# EAGLE design EEZ DIB AUX PS r2B1 (EAGLE 7.2.0)
Assembly variants: Farnell, TME

## Sheet 1 of 2: Power board tester
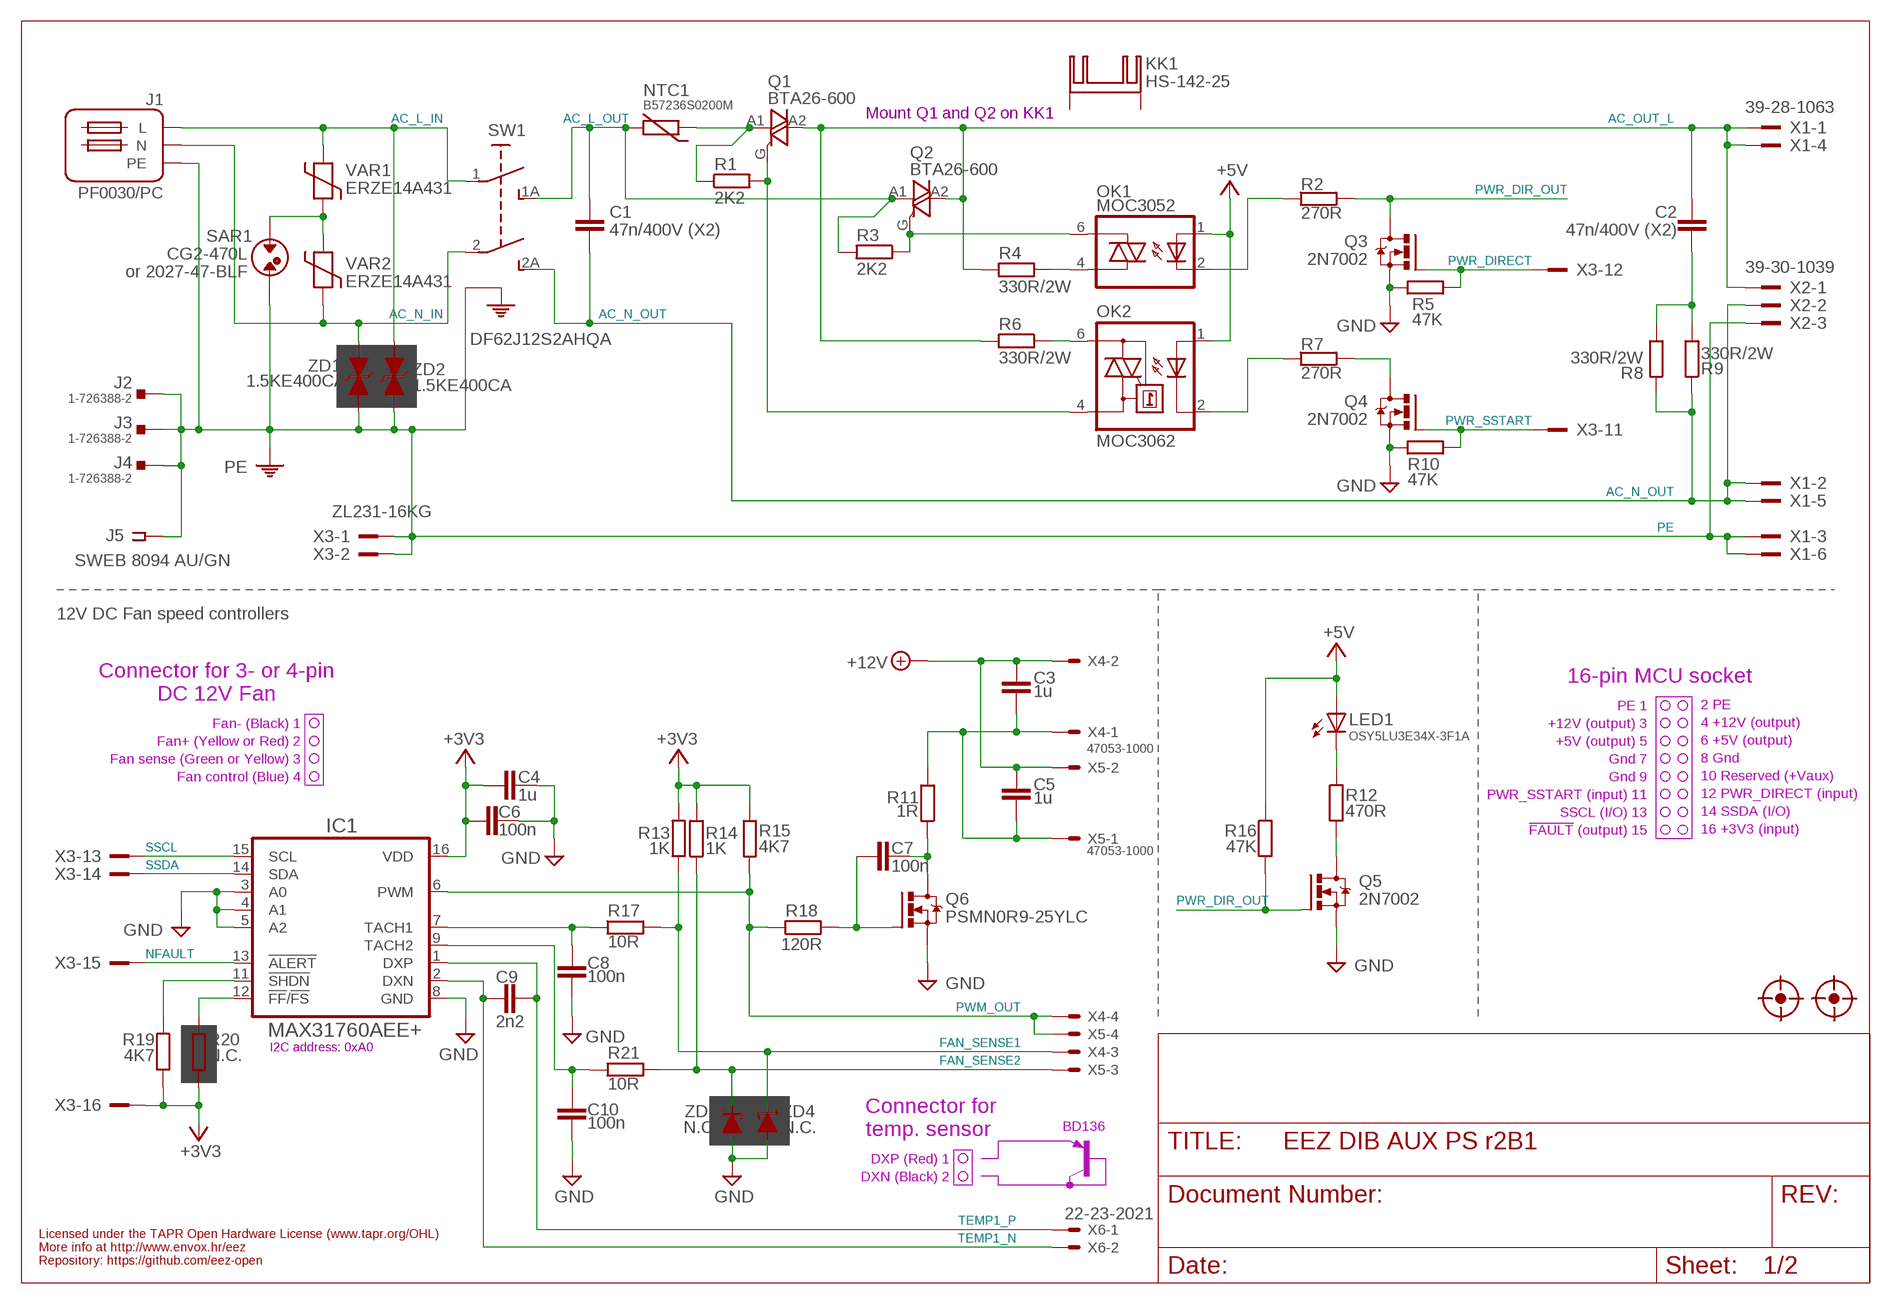
[diagram p0: schematic, sheet 1]

### Parts
C1  47n/400V (X2)  C-EU102-054X133  [C102-054X133]
C2  47n/400V (X2)  C-EU102-054X133  [C102-054X133]
C3  1u  C-EUC0805  [C0805]
C4  1u  C-EUC0805  [C0805]
C5  1u  C-EUC0805  [C0805]
C6  100n  C-EUC0603  [C0603]
C7  100n  C-EUC0805  [C0805]
C8  100n  C-EUC0603  [C0603]
C9  2n2  C-EUC0805  [C0805]
C10  100n  C-EUC0603  [C0603]
FM1  FIDUCIAL  [FIDUCIAL]
FM2  FIDUCIAL  [FIDUCIAL]
IC1  MAX31760AEE+  [DBQ16]
J1  PF0030/PC  [PF0030/PC]
J2  1-726388-2  PCB_TAB4.8MM  [PCB_TAB-4.8MM]
J3  1-726388-2  PCB_TAB4.8MM  [PCB_TAB-4.8MM]
J4  1-726388-2  PCB_TAB4.8MM  [PCB_TAB-4.8MM]
J5  SWEB 8094 AU/GN  BINDING_POSTCLIFF  [S16N-PC]
KK1  HS-142-25  SK129-PAD  [SK129]
LED1  OSY5LU3E34X-3F1A  LEDOSG8  [OSG8]
NTC1  B57236S0200M  NTC11.5X6  [NTC_11.5X6_RM5]
OK1  MOC3052  MOC305X  [DIL6-SMD]
OK2  MOC3062  MOC3033S  [DIL6-SMD]
Q1  BTA26-600  BTA26-V  [TOP3S-1]
Q2  BTA26-600  BTA26-V  [TOP3S-1]
Q3  2N7002  [SOT103P240X110-3N]
Q4  2N7002  [SOT103P240X110-3N]
Q5  2N7002  [SOT103P240X110-3N]
Q6  PSMN0R9-25YLC  N-MOSFETLFPAK  [SOT669]
R1  2K2  R-EU_R0805  [R0805]
R2  270R  R-EU_R0805  [R0805]
R3  2K2  R-EU_R0805  [R0805]
R4  330R/2W  R-EU_R2512  [R2512]
R5  47K  R-EU_R0805  [R0805]
R6  330R/2W  R-EU_R2512  [R2512]
R7  270R  R-EU_R0805  [R0805]
R8  330R/2W  R-EU_R2512  [R2512]
R9  330R/2W  R-EU_R2512  [R2512]
R10  47K  R-EU_R0805  [R0805]
R11  1R  R-EU_R0805  [R0805]
R12  470R  R-EU_R0805  [R0805]
R13  1K  R-EU_R0805  [R0805]
R14  1K  R-EU_R0805  [R0805]
R15  4K7  R-EU_R0805  [R0805]
R16  47K  R-EU_R0805  [R0805]
R17  10R  R-EU_R0805  [R0805]
R18  120R  R-EU_R0805  [R0805]
R19  4K7  R-EU_R0805  [R0805]
R20  N.C.  R-EU_R0805  [R0805]
R21  10R  R-EU_R0805  [R0805]
SAR1  CG2-470L  SAR  [SAR]
SW1  DF62J12S2AHQA  [DF62J12S2]
VAR1  ERZE14A431  VARISTOR-13  [VARISTOR_13MM]
VAR2  ERZE14A431  VARISTOR-13  [VARISTOR_13MM]
X1  39-28-1063  MINIFIT_5566-06A-CRE  [MINIFIT_5566-06A_CRE]
X2  39-30-1039  MINIFIT_39301039-CREEPAGE  [MINIFIT_39301039_CRE]
X3  ZL231-16KG  IDC-16PIN-ANGLED  [ML16L]
X4  47053-1000  [47053-1000]
X5  47053-1000  [47053-1000]
X6  22-23-2021  [22-23-2021]
ZD1  1.5KE400CA  1.5KE-BIDIR  [DO201-BIDIR]
ZD2  1.5KE400CA  1.5KE-BIDIR  [DO201-BIDIR]
ZD3  N.C.  ZENER-DIODESOD123  [SOD123]
ZD4  N.C.  ZENER-DIODESOD123  [SOD123]

### Nets
+3V3: C4.2 C6.2 IC1.16(VDD) R13.2 R14.2 R15.1 R19.2 R20.2 X3.16
+5V: LED1.A OK1.1(A) OK2.1(A) R16.1 ; also sheet 2
+12V: C3.1 C5.1 X4.2 X5.2 ; also sheet 2
AC_L_IN: J1.L SW1.1(P) VAR1.2 ZD2.A
AC_L_OUT: C1.1 NTC1.1 Q2.A1 R3.2 SW1.1A(S) ; also sheet 2
AC_N_IN: J1.N SW1.2(P1) VAR2.1 ZD1.A
AC_N_OUT: C1.2 R8.1 R9.1 SW1.2A(S1) X1.2 X1.5 X2.2 ; also sheet 2
AC_OUT_L: C2.1 Q1.A2 Q2.A2 R4.2 R6.2 X1.1 X1.4 X2.1
DRAIN: C7.1 Q6.MB(D) R11.1
FAN_OUT: C3.2 C5.2 R11.2 X4.1 X5.1
FAN_SENSE1: R13.1 R17.2 X4.3 ZD4.C
FAN_SENSE2: R14.1 R21.2 X5.3 ZD3.C
GND [gnd]: C4.1 C6.1 C8.2 C10.2 IC1.3(A0) IC1.4(A1) IC1.5(A2) IC1.8(GND) Q3.2(S) Q4.2(S) Q5.2(S) Q6.1(S) Q6.2(S) Q6.3(S) R5.1 R10.1 ZD3.A ZD4.A ; also sheet 2
N$1: NTC1.2 Q1.A1 R1.1
N$2: C8.1 IC1.7(TACH1) R17.1
N$3: IC1.12(!FF!/!FS!) R20.1
N$6: SAR1.P$1 VAR1.1 VAR2.2
N$7: OK2.2(C) R7.1
N$10: OK1.2(C) R2.1
N$13: Q5.3(D) R12.2
N$14: LED1.C R12.1
N$15: C7.2 Q6.4(G) R18.2
N$16: Q4.3(D) R7.2
N$18: IC1.11(!SHDN) R19.1
N$21: C10.1 IC1.9(TACH2) R21.1
N$71: OK1.6(A2) Q2.G R3.1
N$72: OK2.4(A1) Q1.G R1.2
N$73: OK2.6(A2) R6.1
N$76: OK1.4(A1) R4.1
N$83: C2.2 R8.2 R9.2
NFAULT: IC1.13(!ALERT) X3.15
PE: J1.PE J2.P$1 J2.P$2 J3.P$1 J3.P$2 J4.P$1 J4.P$2 J5.1 J5.NC1 J5.NC2 J5.NC3 J5.NC4 SAR1.P$2 SW1.PE1(PE) SW1.PE2(PE) X1.3 X1.6 X2.3 X3.1 X3.2 ZD1.C ZD2.C ; also sheet 2
PWM_OUT: IC1.6(PWM) R15.2 R18.1 X4.4 X5.4
PWR_DIR_OUT: Q3.3(D) Q5.1(G) R2.2 R16.2
PWR_DIRECT: Q3.1(G) R5.2 X3.12
PWR_SSTART: Q4.1(G) R10.2 X3.11
SSCL: IC1.15(SCL) X3.13
SSDA: IC1.14(SDA) X3.14
TEMP1_N [diff]: C9.2 IC1.2(DXN) X6.2
TEMP1_P [diff]: C9.1 IC1.1(DXP) X6.1
Unconnected: KK1.A2,5(K) KK1.B2,5(K) X3.10

### Notes on the sheet
- Mount Q1 and Q2 on KK1
- or 2027-47-BLF
- 12V DC Fan speed controllers
- 16-pin MCU socket
- Connector for 3- or 4-pin
  DC 12V Fan
- PE 1
- 2 PE
- Fan- (Black) 1 | +12V (output) 3
- 4 +12V (output)
- Fan+ (Yellow or Red) 2 | +5V (output) 5
- 6 +5V (output)
- Fan sense (Green or Yellow) 3 | Gnd 7
- 8 Gnd
- Fan control (Blue) 4 | Gnd 9
- 10 Reserved (+Vaux)
- PWR_SSTART (input) 11
- 12 PWR_DIRECT (input)
- SSCL (I/O) 13
- 14 SSDA (I/O)
- !FAULT! (output) 15
- 16 +3V3 (input)
- I2C address: 0xA0
- BD136
- Connector for
  temp. sensor
- DXP (Red) 1
- DXN (Black) 2
- Licensed under the TAPR Open Hardware License (www.tapr.org/OHL)
- More info at http://www.envox.hr/eez
- Repository: https://github.com/eez-open

## Sheet 2 of 2
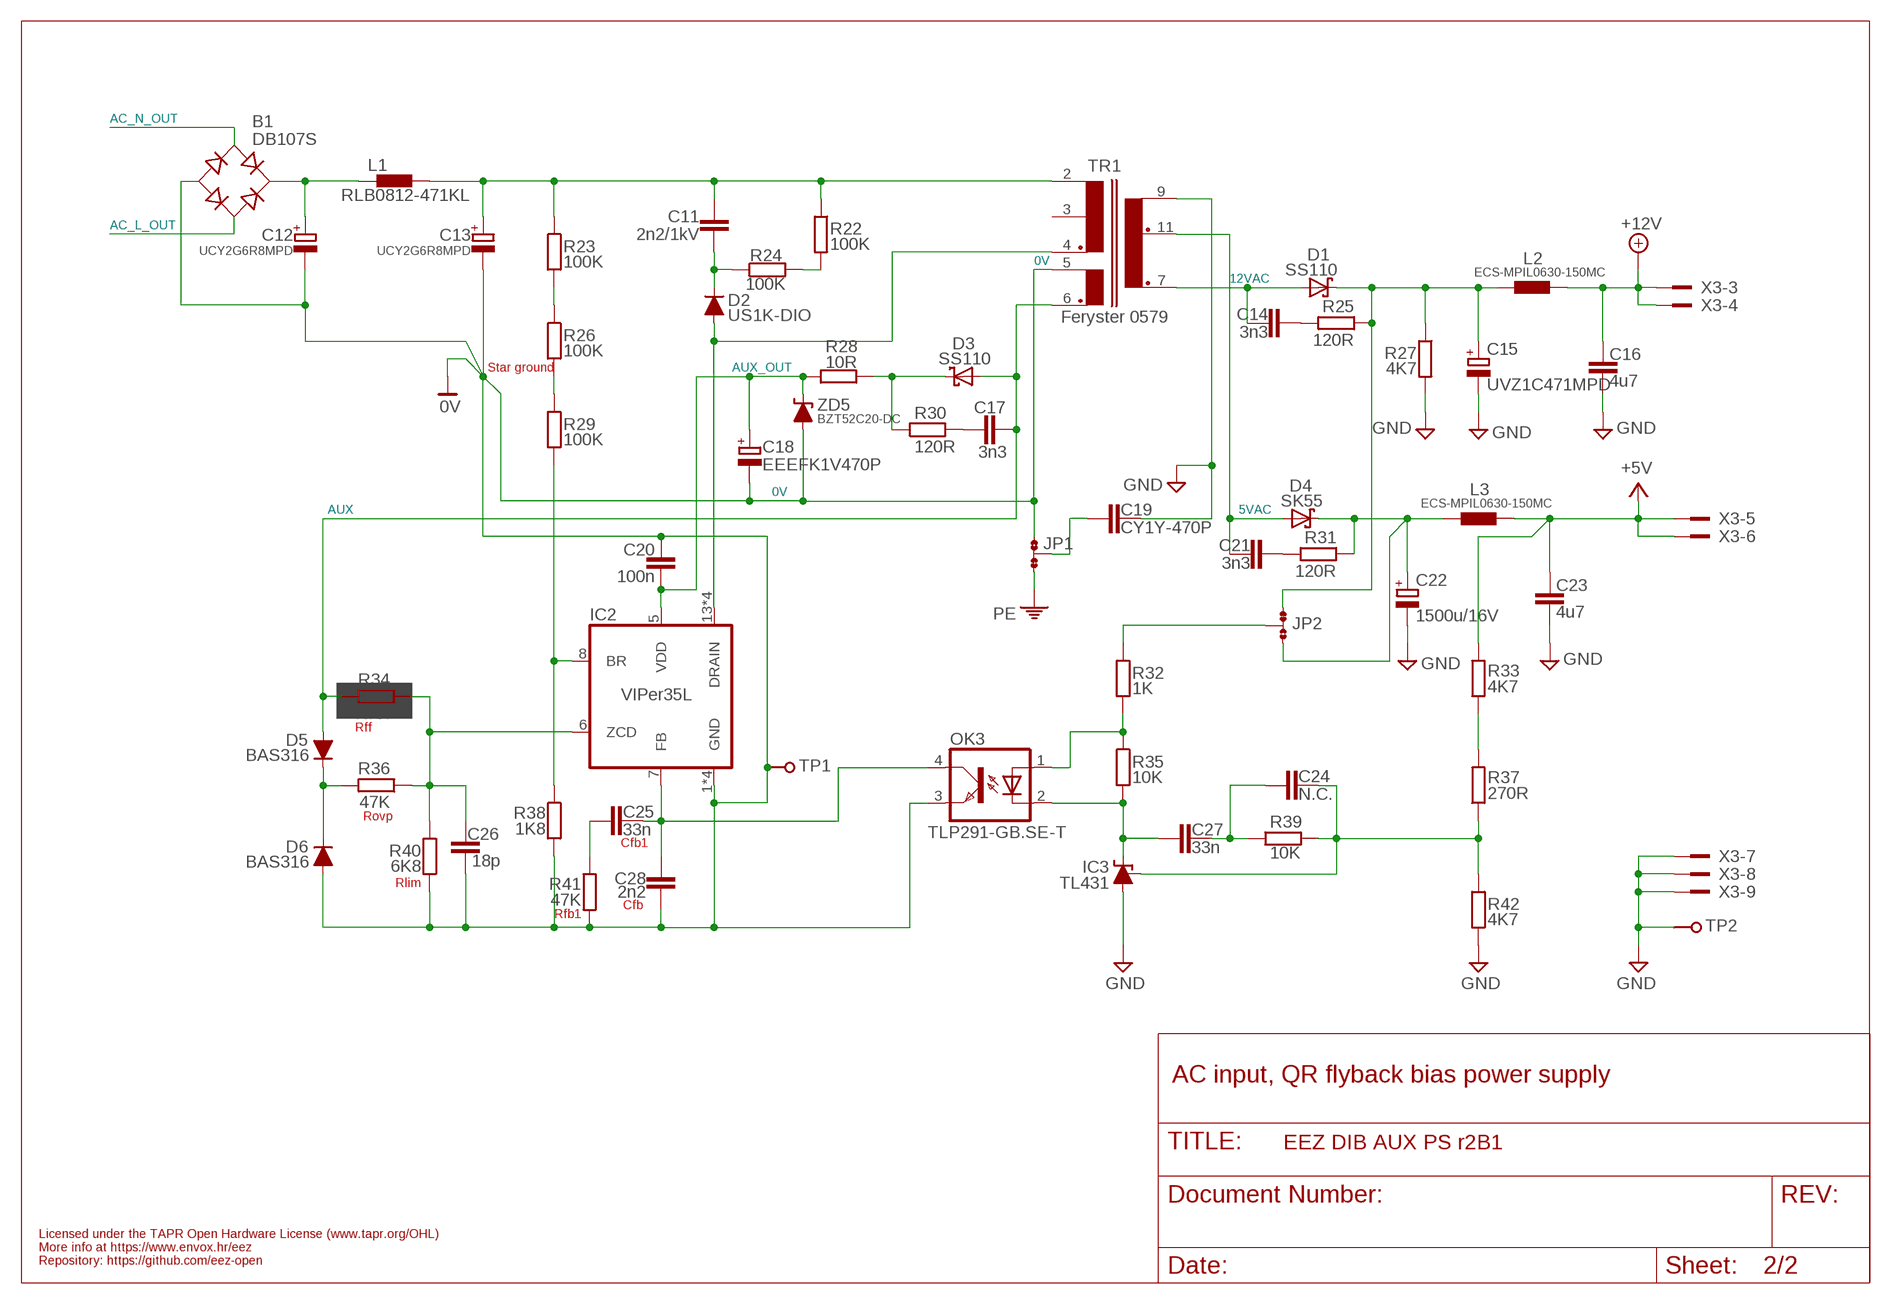
[diagram p1: schematic, sheet 2]

### Parts
B1  DB107S  DBS107G  [DBS]
C11  2n2/1kV  C-EUC1210  [C1210]
C12  UCY2G6R8MPD  ECAP5G_10.5MM  [ECAP5/10.5]
C13  UCY2G6R8MPD  ECAP5G_10.5MM  [ECAP5/10.5]
C14  3n3  C-EUC0805  [C0805]
C15  UVZ1C471MPD  ECAP3.5G_8MM  [ECAP3.5/8]
C16  4u7  C-EUC1210  [C1210]
C17  3n3  C-EUC0805  [C0805]
C18  EEEFK1V470P  ECAPPANASONIC_H  [CAPAE660X610N]
C19  CY1Y-470P  C-EUCY  [CY075-032X103]
C20  100n  C-EUC0603  [C0603]
C21  3n3  C-EUC0805  [C0805]
C22  1500u/16V  ECAP5G_13MM  [ECAP5/13]
C23  4u7  C-EUC1210  [C1210]
C24  N.C.  C-EUC0805  [C0805]
C25  33n  C-EUC0805  [C0805]
C26  18p  C-EUC0603  [C0603]
C27  33n  C-EUC0805  [C0805]
C28  2n2  C-EUC0805  [C0805]
D1  SS110  SCHOTTKYSMB  [SMB]
D2  US1K-DIO  DIODEDO214AA  [DO214AA]
D3  SS110  SCHOTTKYSMB  [SMB]
D4  SK55  SCHOTTKYSMB  [SMB]
D5  BAS316  DIODESOD323R  [SOD323-R]
D6  BAS316  DIODESOD323R  [SOD323-R]
IC2  VIPer35L  VIPER35  [SOIC-16]
IC3  TL431  [SOT103P240X110-3N]
JP1  JP3-CUT  [JP3-CUT]
JP2  JP3-CUT  [JP3-CUT]
L1  RLB0812-471KL  FERYSTER_DSZ6  [FERSYTER_DSZ6]
L2  ECS-MPIL0630-150MC  DE0704  [DE0704]
L3  ECS-MPIL0630-150MC  DE0704  [DE0704]
OK3  TLP291-GB.SE-T  TLP291  [SO4]
R22  100K  R-EU_R1206  [R1206]
R23  100K  R-EU_R1206  [R1206]
R24  100K  R-EU_R1206  [R1206]
R25  120R  R-EU_R0805  [R0805]
R26  100K  R-EU_R1206  [R1206]
R27  4K7  R-EU_R0805  [R0805]
R28  10R  R-EU_R0805  [R0805]
R29  100K  R-EU_R1206  [R1206]
R30  120R  R-EU_R0805  [R0805]
R31  120R  R-EU_R0805  [R0805]
R32  1K  R-EU_R0805  [R0805]
R33  4K7  R-EU_R0805  [R0805]
R34  N.C.  R-EU_R0805  [R0805]
R35  10K  R-EU_R0805  [R0805]
R36  47K  R-EU_R0805  [R0805]
R37  270R  R-EU_R0805  [R0805]
R38  1K8  R-EU_R0805  [R0805]
R39  10K  R-EU_R0805  [R0805]
R40  6K8  R-EU_R0805  [R0805]
R41  47K  R-EU_R0805  [R0805]
R42  4K7  R-EU_R0805  [R0805]
TP1  PCB_TEST_TABSHIELD  [PCB_SHIELD_TAB]
TP2  PCB_TEST_TABSHIELD  [PCB_SHIELD_TAB]
TR1  Feryster 0579  FERYSTER_0579  [FERYSTER_0579]
ZD5  BZT52C20-DC  ZENER-DIODESOD123  [SOD123]

### Nets
0V: B1.- C12.- C13.- C18.2(-) C20.1 C26.2 C28.2 D6.A IC2.1(GND) IC2.2(GND) IC2.3(GND) IC2.4(GND) JP1.NO OK3.3(EMIT) R38.2 R40.1 R41.2 TP1.1 TR1.5(AUX) ZD5.A
5VAC: C21.2 D4.A TR1.11(S1_DOT)
12VAC: C14.2 D1.A TR1.7(S2_DOT)
+5V: C23.1 L3.2 R33.2 X3.5 X3.6 ; also sheet 1
+5V_REC: C22.+ D4.C JP2.NO L3.1 R31.1
+12V: C16.1 L2.2 X3.3 X3.4 ; also sheet 1
+12V_REC: C15.+ D1.C JP2.NC L2.1 R25.1 R27.1
AC_L_OUT: B1.AC2 ; also sheet 1
AC_N_OUT: B1.AC1 ; also sheet 1
AUX: C17.2 D3.A D5.A R34.2 TR1.6(AUX_DOT)
AUX_OUT: C18.1(+) C20.2 IC2.5(VDD) R28.2 ZD5.C
AUX_REC: D3.C R28.1 R30.1
DC_BUS: C11.1 C13.+ L1.P$2 R22.1 R23.1 TR1.2(P1)
FB1: C27.1 IC3.1(C) OK3.2(C) R35.2
GND [gnd]: C15.- C16.2 C19.2 C22.- C23.2 IC3.3(A) R27.2 R42.1 TP2.1 TR1.9(S_COMM) X3.7 X3.8 X3.9 ; also sheet 1
N$4: C19.1 JP1.COM
N$5: OK3.1(A) R32.2 R35.1
N$8: C14.1 R25.2
N$9: B1.+ C12.+ L1.P$1
N$11: R26.2 R29.1
N$12: JP2.COM R32.1
N$17: R22.2 R24.2
N$20: IC2.8(BR) R29.2 R38.1
N$22: R33.1 R37.2
N$49: R23.2 R26.1
N$137: C11.2 D2.C R24.1
N$138: C25.2 C28.1 IC2.7(FB) OK3.4(COL)
N$140: C17.1 R30.2
N$141: C26.1 IC2.6(ZCD) R34.1 R36.1 R40.2
N$146: C21.1 R31.2
N$148: C24.2 IC3.2(REF) R37.1 R39.2 R42.2
N$149: C24.1 C27.2 R39.1
N$152: C25.1 R41.1
N$155: D5.C D6.C R36.2
PE: JP1.NC ; also sheet 1
VIPER_D: D2.A IC2.13(DRAIN) IC2.14(DRAIN) IC2.15(DRAIN) IC2.16(DRAIN) TR1.4(P1_DOT)
Unconnected: TR1.3(P1_MIDDLE)

### Notes on the sheet
- Star ground
- Rff
- Rovp
- Cfb1
- Rlim
- Cfb
- Rfb1
- AC input, QR flyback bias power supply
- Licensed under the TAPR Open Hardware License (www.tapr.org/OHL)
- More info at https://www.envox.hr/eez
- Repository: https://github.com/eez-open

## Library data of the parts
B1 = rectifier:DB?*G: Single Phase 1.0 AMP Glass Passivated Bridge Rectifier Taiwan Semiconductor Co.,Ltd. - TSC Source: http://www.taiwansemi.com/TSCbig5/ezcatfiles/cust/img/img/db101g.pdf http://www.ts.com.tw/db/pictures/modules/PDT/PDT060207001/DBLS201G.pdf
C1-C11 C14 C16 C17 C20 C21 C23-C28 = rcl:C-EU: CAPACITOR, European symbol
C12 C13 C15 C18 C22 = EEZ_Lib1:ECAP
C19 = EEZ_Lib1:C-EU
D1 D3 D4 = EEZ_Lib1:SCHOTTKY
D2 D5 D6 = EEZ_Lib1:DIODE
FM1 FM2 = EEZ_Lib1:FIDUCIAL: Fiducial mark for pick and place automation
IC1 = EEZ_DIB:MAX31760AEE+: Precision Fan-Speed Controller with Nonvolatile Lookup Table
IC2 = EEZ_Lib1:VIPER35: Quasi-resonant high performance off line high voltage converter, 800 V
IC3 = EEZ_Lib1:TL431: Precision programmable reference
J1 = EEZ_connectors:PF0030/PC: PC Flanged Mount Fused Inlet, twin fused 5 x 20 mm, 250 Vac, 10 A, PC spills
J2-J4 = EEZ_connectors:PCB_TAB
J5 = EEZ_Lib1:BINDING_POST: Various 4 mm binding posts
JP1 JP2 = EEZ_Lib1:JP3-CUT
KK1 = EEZ_DIB:SK129-PAD: Extruded heatsink; SOT32,TO220,TO3P; L:25.4mm; 7.8K/W Compatible model: Stonecold HS-142-25
L1 = EEZ_Lib1:FERYSTER_DSZ6: Feryster DSZ type choke on RSZ ferrite core
L2 L3 = EEZ_inductors_and_transformers:DE0704: Ferrocore SMD power coil 7.3 x 7.3 mm
LED1 = EEZ_Lib1:LED
NTC1 = EEZ_Lib1:NTC
OK1 = EEZ_Lib1:MOC305X: 6-pin DIP Random-phase Optoisolators Triac Drivers (600V Peak)
OK2 = optocoupler:MOC30*: 6-Pin DIP Zero-Cross Optoisolators Triac Driver Output (250/400 Volt Peak) Source: http://www.fairchildsemi.com/ds/MO/MOC3043-M.pdf; MF: FAIRCHILD SEMICONDUCTOR; MPN: MOC3033S-M; OC_FARNELL: unknown; OC_NEWARK: 05C2878
OK3 = EEZ_Lib1:TLP291: Toshiba Photocopler GaAs IRED & Photo-transistor
Q1 Q2 = triac:BTA26: 25A TRIAC Source: http://www.st.com/stonline/products/literature/ds/7470.pdf
Q3-Q5 = EEZ_Lib1:2N7002: N-CHANNEL ENHANCEMENT MODE FIELD EFFECT TRANSISTOR; MPN: 2N7002-7-F; OC_FARNELL: 1713823; OC_NEWARK: 25R5679; PACKAGE: SOT-23-3; SUPPLIER: DIODES INC.
Q6 = EEZ_Lib1:N-MOSFET
R1-R42 = rcl:R-EU_: RESISTOR, European symbol
SAR1 = EEZ_Lib1:SAR: EPCOS surge arrester EF470X Farnell: 1886596
SW1 = EEZ_switches:DF62J12S2: Rocker switch SPST; Positions:2; OFF-ON; 16A/250VAC; 6A/48VDC
TP1 TP2 = EEZ_Lib1:PCB_TEST_TAB
TR1 = EEZ_inductors_and_transformers:FERYSTER_0579: Flyback transformer, 1.04mH, 35W
VAR1 VAR2 = EEZ_Lib1:VARISTOR: EPCOS - B72220S0251K101 - VARISTOR, 140J, 250VAC Farnell: 1004357
X1 = EEZ_connectors:MINIFIT_5566-06A: Molex Socket; wire-board; male; Mini-Fit Jr; 4.2mm; PIN:6; THT; 9A; tinned
X2 = EEZ_connectors:MINIFIT_39301039: MOLEX socket; wire-board; male; Mini-Fit Jr; 4.2mm; PIN:3; THT; PCB snap
X3 = EEZ_connectors:IDC-16PIN: 16-pin IDC socket
X4 X5 = EEZ_connectors:47053-1000: KK 254 Vertical Header, with Friction Lock, 4 Circuits, PC Tail Length: 3.50mm
X6 = con-molex:22-23-2021: .100" (2.54mm) Center Header - 2 Pin; MF: MOLEX; MPN: 22-23-2021; OC_FARNELL: 1462926; OC_NEWARK: 25C3832
ZD1 ZD2 = EEZ_Lib1:1.5KE-BIDIR
ZD3-ZD5 = EEZ_Lib1:ZENER-DIODE

## Net classes
0 default: width 0.152 mm, drill 0.3 mm, clearance 0.152 mm
1 diff: width 0.254 mm, drill 0.3 mm, clearance 0.254 mm
2 gnd: width 0.152 mm, drill 0.3 mm, clearance 0.152 mm

## Board
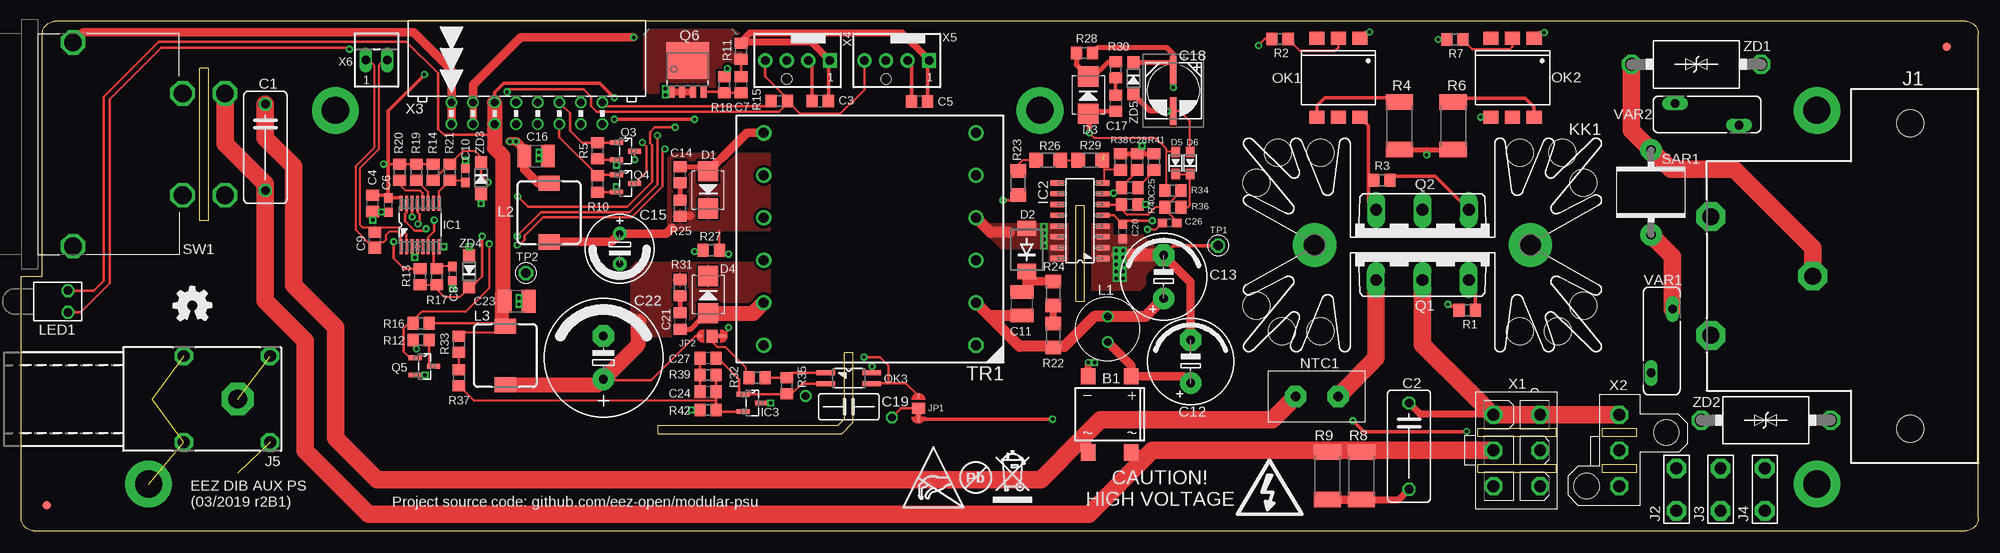
[diagram p2: board, top side]
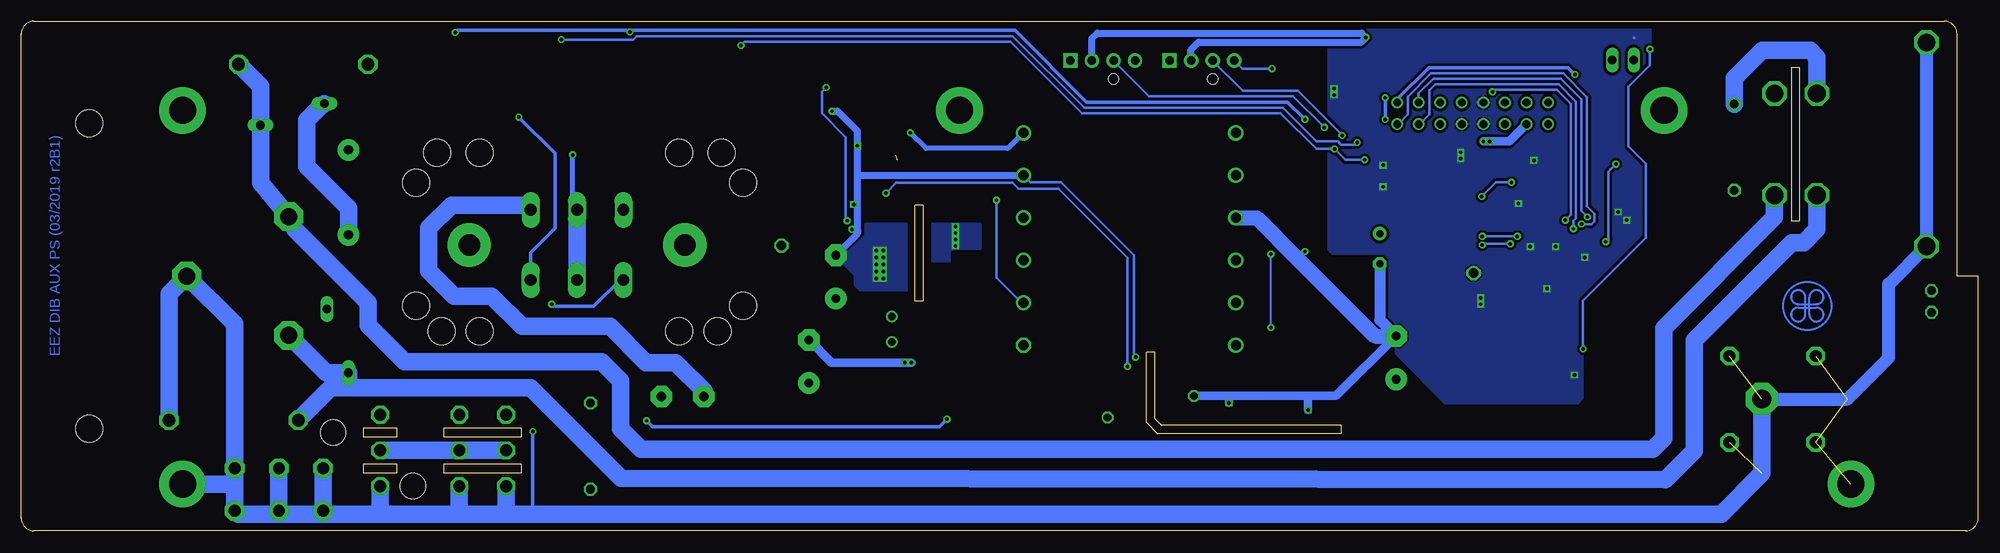
[diagram p3: board, bottom side, seen from below]

Size 230.5 x 60 mm. Coordinates in mm from the lower left corner, seen from the top.
Outline: 1.5,0 229,0 arc90 230.5,1.5 230.5,58.5 arc90 229,60 4,60 arc90 2.5,58.5 2.5,30 0,30 0,1.5 arc90 1.5,0
Outline: 74.99,11.43 96.65,11.43 97.98,12.76 97.98,21.02 96.97,21.02 96.97,13.21 96.2,12.45 74.99,12.45 74.99,11.43
Outline: 124.21,27.05 124.21,38.35 125.22,38.35 125.22,27.05 124.21,27.05
Copper layers (1*16): Top 0.035mm / dielectric 1.5mm / Bottom 0.035mm
Design rules "default *": minimum track width 6mil, minimum drill 0.3mm, track to track 4mil, track to pad 4mil, pad to pad 4mil, via to via 4mil, smd to smd 4mil, copper to edge 30mil, drill to drill 8mil, minimum pad ring 4mil, minimum via ring 8mil, stop-mask expansion 2.5mil, vias tented up to drill 0.6mm, thermal gap 8mil
Holes 3.2 mm at 153,44.5 148,44.5 176.5,44.5 181.5,44.5 153,23.5 148.5,23.5 145.5,26.5 145.5,41 184,41 184,26.5 181,23.5 176.5,23.5

### Footprints (pad centres in the part's own frame; a part is rotated, then mirrored left to right if it is on the bottom)
DBS = smd 1.7 x 1.9: + -2.55,-4.5; - 2.55,-4.5; AC1 -2.55,4.5; AC2 2.55,4.5
C102-054X133 = drill 1.016 octagon: 1 -5.08,0; 2 5.08,0
C0805 = smd 1.3 x 1.5: 1 -0.95,0; 2 0.95,0
C0603 = smd 1.1 x 1: 1 -0.85,0; 2 0.85,0
C1210 = smd 1.6 x 2.7: 1 -1.4,0; 2 1.4,0
ECAP5/10.5 = drill 1.016 pad 2.54: + -2.54,0 | drill 1.016 pad 2.54 octagon: - 2.54,0
ECAP3.5/8 = drill 0.813 pad 1.6: + -1.778,0 | drill 0.813 pad 1.6 octagon: - 1.778,0
CAPAE660X610N = smd 3.251 x 0.762: 1 -2.413,0; 2 2.413,0
CY075-032X103 = drill 0.914 octagon: 1 -5.08,1.27; 2 5.08,-1.27
ECAP5/13 = drill 1.016 pad 2.54: + -2.54,0 | drill 1.016 pad 2.54 octagon: - 2.54,0
SMB = smd 2.4 x 2.4: A 2.2,0; C -2.2,0
DO214AA = smd 1.8 x 2.2: A 2.55,0; C -2.55,0
SOD323-R = smd 1.2 x 1: A 1.3,0; C -1.3,0
FIDUCIAL = smd 1.016 x 1.016: T 0,0
DBQ16 = smd 1.803 x 0.356: 1 -2.553,2.223; 2 -2.553,1.587; 3 -2.553,0.953; 4 -2.553,0.318; 5 -2.553,-0.318; 6 -2.553,-0.953; 7 -2.553,-1.587; 8 -2.553,-2.223; 9 2.553,-2.223; 10 2.553,-1.587; 11 2.553,-0.953; 12 2.553,-0.318; 13 2.553,0.318; 14 2.553,0.953; 15 2.553,1.587; 16 2.553,2.223
SOIC-16 = smd 1.549 x 0.61: 1 -2.692,4.445; 2 -2.692,3.175; 3 -2.692,1.905; 4 -2.692,0.635; 5 -2.692,-0.635; 6 -2.692,-1.905; 7 -2.692,-3.175; 8 -2.692,-4.445; 9 2.692,-4.445; 10 2.692,-3.175; 11 2.692,-1.905; 12 2.692,-0.635; 13 2.692,0.635; 14 2.692,1.905; 15 2.692,3.175; 16 2.692,4.445
SOT103P240X110-3N = smd 1.524 x 0.559: 1 -1.079,1.016; 2 -1.079,-1.016; 3 1.079,0
PF0030/PC = drill 2 pad 3.4 octagon: L -7,31.5; N 7,31.5; PE 0,19.5 | hole 3.2: 18,8; -18,8
PCB_TAB-4.8MM = drill 1.4 pad 2.3 octagon: P$1 -2.54,0; P$2 2.46,0
S16N-PC = drill 2.2 pad 3.81 octagon: 1 0,0 | drill 1.4 pad 2.184 octagon: NC1 -3.8,5.08; NC2 -3.8,-5.08; NC3 6.36,5.08; NC4 6.36,-5.08
JP3-CUT = smd 1.27 x 1.524: COM 0,0 | smd 0.889 x 0.254: NC -1.27,0 | smd 0.508 x 0.254: NO 1.46,0
SK129 = drill 2.54 pad 5.08: A2,5 -12.7,-0.889; B2,5 12.7,-0.889
FERSYTER_DSZ6 = drill 0.9: P$1 -1.5,0; P$2 1.5,0
DE0704 = smd 2.5 x 1.8: 1 0,3.45; 2 0,-3.45
OSG8 = drill 1 octagon: A 0,1.27; C 0,-1.27
NTC_11.5X6_RM5 = drill 1.1 pad 2.54 octagon: 1 -2.5,0; 2 2.5,0
DIL6-SMD = smd 1.78 x 1.52: 1 -2.54,-4.645; 2 0,-4.645; 3 2.54,-4.645; 4 2.54,4.645; 5 0,4.645; 6 -2.54,4.645
SO4 = smd 0.6 x 2.2: 1 -0.635,-2.7; 2 0.635,-2.7; 3 0.635,2.7; 4 -0.635,2.7
TOP3S-1 = drill 1.397 long: A1 -5.461,-3.175; A2 0,-3.175; G 5.461,-3.175
SOT669 = smd 0.7 x 1.4: 1 -1.905,-2.65; 2 -0.635,-2.65; 3 0.635,-2.65; 4 1.905,-2.65 | smd 5 x 4.3: MB 0,1
R0805 = smd 1.3 x 1.5: 1 -0.95,0; 2 0.95,0
R2512 = smd 1.8 x 3.2: 1 -2.8,0; 2 2.8,0
R1206 = smd 1.6 x 1.803: 1 -1.422,0; 2 1.422,0
SAR = drill 1.1 pad 2.54: P$1 0,0; P$2 10,0
DF62J12S2 = drill 2.1 octagon: 1 17,-6; 1A 17,6; 2 22,-6; 2A 22,6; PE1 4.1,-12; PE2 4.1,12
PCB_SHIELD_TAB = drill 1.1 octagon: 1 0,0
FERYSTER_0579 = drill 1.2 octagon: 1 -12.5,12.5 | drill 1.2: 2 -12.5,7.5; 3 -12.5,2.5; 4 -12.5,-2.5; 5 -12.5,-7.5; 6 -12.5,-12.5; 7 12.5,-12.5; 8 12.5,-7.5; 9 12.5,-2.5; 10 12.5,2.5; 11 12.5,7.5; 12 12.5,12.5
VARISTOR_13MM = drill 1.016 long: 1 3.75,-1.27; 2 -3.75,1.27
MINIFIT_5566-06A_CRE = drill 1.4 octagon: 1 -4.2,2.75; 2 0,2.75; 3 4.2,2.75; 4 -4.2,-2.75; 5 0,-2.75; 6 4.2,-2.75
MINIFIT_39301039_CRE = drill 1.4 octagon: 1 0,4.2; 2 0,0; 3 0,-4.2 | hole 3: 5.55,2.1; -3.85,-4.2
ML16L = drill 0.914: 1 -8.89,-1.27; 2 -8.89,1.27; 3 -6.35,-1.27; 4 -6.35,1.27; 5 -3.81,-1.27; 6 -3.81,1.27; 7 -1.27,-1.27; 8 -1.27,1.27; 9 1.27,-1.27; 10 1.27,1.27; 11 3.81,-1.27; 12 3.81,1.27; 13 6.35,-1.27; 14 6.35,1.27; 15 8.89,-1.27; 16 8.89,1.27
47053-1000 = drill 1 pad 1.676 square: 1 3.81,0 | drill 1 pad 1.676: 2 1.27,0; 3 -1.27,0; 4 -3.81,0 | hole 1.25: -1.27,-2.16
22-23-2021 = drill 1 long: 1 -1.27,0; 2 1.27,0
DO201-BIDIR = drill 1.499 octagon: A 7.62,0; C -7.62,0
SOD123 = smd 1.4 x 1.4: A 1.9,0; C -1.9,0

### Placement (x,y rotation side)
B1  128.21,13.72 180 top
C1  28.76,45.16 270 top
C2  163.45,9.97 270 top
C3  94.11,50.61 0 top
C4  41.4,38.54 90 top
C5  105.79,50.55 0 top
C6  43.24,38.35 90 top
C7  84.77,52.51 270 top
C8  50.8,30.29 270 top
C9  41.66,34.23 90 top
C10  52.32,41.85 90 top
C11  117.86,26.73 90 top
C12  137.73,19.94 90 top
C13  134.56,29.91 90 top
C14  77.6,41.91 90 top
C15  70.48,33.21 270 top
C16  60.64,44.13 0 top
C17  128.91,50.36 270 top
C18  135.7,51.82 270 top
C19  97.47,14.61 180 top
C20  129.73,35.24 90 top
C21  77.6,24.7 270 top
C22  68.58,20.38 90 top
C23  58.36,27.05 0 top
C24  80.9,16.38 0 top
C25  130.56,40.39 180 top
C26  135.25,36.26 180 top
C27  80.9,20.32 180 top
C28  131.44,43.43 90 top
D1  80.9,40.13 90 top
D2  118.43,33.08 90 top
D3  125.67,51.31 270 top
D4  80.9,27.81 270 top
D5  135.95,43.31 90 top
D6  137.67,43.31 90 top
EEZ_SIGNATURE  SIGNATURESMALL  [SIGNATURE_5MM]  20.14,26.49 180 top
FM1  3,3 0 top
FM2  226.8,57 0 top
IC1  46.99,36 90 top
IC2  124.71,36.51 180 top
IC3  86.11,15.05 0 top
J1  230.5,30 90 top
J2  194.94,4.89 90 top
J3  200.15,4.89 90 top
J4  205.36,4.89 90 top
J5  25.5,15.5 180 top
JP1  105.66,14.41 90 top
JP2  81.36,22.93 180 top
KK1  165.04,34.54 0 top
L1  127.95,23.75 90 top
L2  62.17,37.47 180 top
L3  57.02,20.64 180 top
LED1  5.5,27 0 top
NTC1  152.59,15.81 0 top
OK1  155.13,53.34 180 top
OK2  175.64,53.34 180 top
OK3  97.47,17.97 270 top
Q1  165.04,32.7 0 top
Q2  165.04,34.61 180 top
Q3  71.18,44.7 0 top
Q4  71.18,40.89 0 top
Q5  47.5,19.37 0 top
Q6  78.49,54.36 0 top
R1  170.31,25.97 0 top
R2  148.27,57.91 180 top
R3  160.27,41.27 0 top
R4  162.31,47.69 270 top
R5  67.88,44.77 90 top
R6  168.66,47.69 270 top
R7  168.85,57.85 180 top
R8  157.86,6.48 270 top
R9  153.86,6.48 270 top
R10  67.88,40.83 90 top
R11  84.77,56.45 90 top
R12  47.12,22.48 0 top
R13  46.99,29.91 90 top
R14  48.51,42.23 90 top
R15  89.28,50.61 0 top
R16  47.12,24.45 180 top
R17  48.96,29.91 270 top
R18  82.8,52.51 270 top
R19  46.55,42.23 90 top
R20  44.58,42.23 90 top
R21  50.48,42.23 90 top
R22  121.54,22.99 90 top
R23  117.41,40.96 90 top
R24  121.54,27.94 270 top
R25  77.6,37.97 90 top
R26  120.97,43.62 0 top
R27  81.28,33.02 180 top
R28  125.22,56.26 0 top
R29  125.92,43.62 0 top
R30  128.91,54.29 270 top
R31  77.6,28.64 270 top
R32  86.68,18.03 0 top
R33  51.56,21.97 90 top
R34  135.64,40.07 180 top
R35  90.17,17.08 270 top
R36  135.64,38.1 0 top
R37  51.56,18.03 90 top
R38  129.48,43.43 90 top
R39  80.9,18.35 0 top
R40  130.56,38.42 180 top
R41  133.41,43.43 90 top
R42  80.9,14.22 0 top
SAR1  191.95,34.86 90 top
SW1  2,45.5 0 top
TP1  140.97,33.59 0 top
TP2  59.44,30.35 0 top
TR1  99.95,34.35 180 top
U$2  [PB_SMALL]  112.42,6.26 180 top
U$3  [RECYCLE_BIN1/8]  114.46,3.27 0 top
U$4  [ESD_SYMBOL]  103.89,2.75 0 top
VAR1  193.22,22.35 90 top
VAR2  198.56,49.02 0 top
X1  176.15,9.46 270 top
X2  188.21,9.46 0 top
X3  59.56,49.15 0 top
X4  91.44,55.37 0 top
X5  103.12,55.37 0 top
X6  41.85,55.44 0 top
ZD1  197.29,54.93 0 top
ZD2  205.48,13.02 180 top
ZD3  54.17,41.53 270 top
ZD4  52.77,30.54 90 top
ZD5  131,53.28 270 top

### Tracks (layer width: path | path; a pad name or v marks a point on that pad's centre or on a via)
0V  (via drill 0.4)
  Top 0.254: R40.1 v132.46,38.42 | v132.65,35.5 133.64,35.5 C26.2 | C18.2 136.46,49.4 137.67,48.2 D6.A | 133.03,44.77 R41.2
  Top 0.305: OK3.3 100.17,17.37 102.17,17.37 | 102.17,17.37 102.17,19.43 101.16,20.45 v99.25,20.45 | 102.17,17.37 104.17,17.37 JP1.NO
  Top 0.406: TP1.1 135.7,33.59 C13.-
  Top 0.61: R38.2 C28.2 131.95,44.38 R41.2 | 135.76,49.4 C18.2 v135,49.4 132.97,49.4 ZD5.A
  Top 0.762: v132.02,45.34 132.02,44.45 131.95,44.38
  Top 0.813: v126.43,19.81 v125.67,19.81 B1.-
  Top 1.016: C12.- 137.73,29.27 C13.-
  Top 1.524: C13.- 129.16,32.45
  Bottom 0.254: v132.46,38.42 132.02,38.42 | v132.65,35.5 132.02,35.5
  Bottom 0.305: v99.25,20.45 99.19,20.51 99.44,20.77 99.44,32.45 108.01,41.02 111.62,41.02 TR1.5
  Bottom 0.813: 132.02,41.85 132.02,38.42 132.02,35.5 132.02,34.99 C13.- | 132.02,41.85 TR1.5 | 132.02,41.85 v132.02,45.34 132.02,47.05 134.37,49.4 v135,49.4
  Bottom 1.016: v125.67,19.81 135.06,19.81 C12.-
  other vias: 128.97,29.72 128.97,30.54 128.97,31.37 128.97,32.19 128.97,33.02 129.79,29.72 129.79,30.54 129.79,31.37 129.79,32.19 129.79,33.02
  pour Top (isolate 0.254, no thermals): 125.67,36.13 128.46,36.13 128.46,34.8 132.08,34.8 133.86,33.02 133.86,31.62 132.33,30.1 132.33,28.89 131.76,28.32 125.67,28.32
  pour Bottom (isolate 0.254, no thermals): 125.67,36.13 131.13,36.13 131.13,34.8 133.03,32.89 133.86,32.89 133.86,31.62 132.33,30.1 132.33,28.89 131.76,28.32 125.67,28.32
5VAC
  Top 0.61: D4.A 80.88,25.59 80.2,25.59 80.2,25.08 78.87,23.75 C21.2
  Top 1.778: D4.A 86.21,25.61 TR1.11
12VAC
  Top 0.61: C14.2 80.37,42.86 D1.A
  Top 1.016: D1.A 80.92,42.35 80.96,42.35 82.04,43.43 82.49,43.88 85.46,46.85 TR1.7
+3V3  (via drill 0.4)
  Top 0.254: 44.77,38.91 IC1.16 44.77,38.99 44.7,39.24
  Top 0.305: 43.24,43.18 v42.67,43.18 44.2,43.18 R20.2 R19.2 R14.2 | R13.2 45.09,30.86 43.88,32.07 v43.88,34.04 | R15.1 87.82,50.1 87.69,49.97 68.9,49.97 X3.16
  Top 0.406: 43.12,39.33 C6.2 | 44.7,39.24 43.28,39.24 C6.2 | C6.2 43.24,43.18 43.24,49.47 v47.5,53.72 | C4.2 42.95,39.49 C6.2
  Bottom 0.305: 43.31,42.55 v42.67,43.18 43.56,42.29 43.56,34.35 v43.88,34.04
  Bottom 0.406: v47.5,53.72 48.32,54.55 64.71,54.55 68.45,50.8 X3.16
+5V  (via drill 0.4)
  Top 0.254: 56.13,24.45 56.66,24.45 | R33.2 51.56,23.11 51.63,23.18 51.63,23.3 51.69,23.37 56.3,23.37 L3.2 | 56.77,42.93 56.71,42.99
  Top 0.305: 178.24,58.05 OK2.1 | LED1.A 8.52,28.27 9.72,29.46 9.72,51.12 16.19,57.59 45.34,57.59 49.09,53.85 49.09,47.31 49.78,46.61 55.12,46.61 55.75,47.24 | 56.13,24.45 R16.1 | 56.66,27.11 56.73,27.05 C23.1 56.52,27.49 56.71,27.88
  Top 0.406: OK1.1 158.42,58.74 v158.81,58.74 | v179.39,58.67 178.87,58.67 OK2.1 | X3.6 55.75,51.63 56.83,52.7 68.14,52.7 v69.85,50.99 | v69.85,48.45 v79.31,48.45
  Top 1.676: L3.2 56.66,24.45 56.66,28.15 56.71,28.19
  Top 1.778: X3.6 X3.5 55.75,47.24 55.75,45.09 56.71,44.13 56.71,42.99 56.71,28.19 56.71,27.88
  Bottom 0.406: v179.39,58.67 179.13,58.93 159,58.93 v158.81,58.74 158.62,58.93 113.47,58.93 105.03,50.48 81.34,50.48 v79.31,48.45 | v69.85,50.99 v69.85,48.45
+5V_REC
  Top 0.305: C22.+ 68.71,17.72 74.17,17.72 79.38,22.93 JP2.NO
  Top 1.778: 72.77,24.64 72.71,24.57 72.71,21.97 C22.+ 67.92,17.19 L3.1
  pour Top (isolate 0.305): 72.45,31.62 88.14,31.62 88.14,24.89 78.74,24.89 76.71,22.86 71.88,22.86 71.88,31.05
+12V  (via drill 0.4)
  Top 0.406: C5.1 104.84,54.92 X5.2 | C3.1 93.16,54.92 X4.2
  Top 0.813: X3.4 X3.3
  Top 1.016: v57.53,45.85 v58.29,45.85 59.24,44.9 C16.1 59.24,42.55 60.9,40.89 62.15,40.89 L2.2 | X3.4 53.21,52.51 58.8,58.1 v72.14,58.1
  Bottom 0.813: X4.2 92.71,56.64 91.82,57.53 72.64,57.53 72.14,58.04 v72.14,58.1 72.64,58.61 103.76,58.61 104.39,57.98 X5.2
  Bottom 1.016: v58.29,45.85 v57.53,45.85 55.24,45.85 X3.3
  Bottom 1.27: 53.15,47.82 X3.3
+12V_REC  (via drill 0.4)
  Top 0.254: R27.1 82.23,35.37 | v83.31,23.94 83.31,23.61 JP2.NC
  Top 0.406: v83.31,32.58 82.67,32.58 R27.1
  Top 1.016: 78.78,37.08 77.6,37.08 R25.1 | L2.1 69.51,34.02 C15.+ 75.95,34.99 76.64,35.69
  Bottom 0.254: v83.31,23.94 v83.31,32.58
  pour Top (isolate 0.305): 76.2,43.88 76.77,44.45 88.14,44.45 88.14,35.31 76.77,35.31 76.2,35.88
AC_L_IN
  Bottom 2.032: 192.14,16.83 191.95,17.02 VAR1.2 194.6,18.6 J1.L | 192.14,16.83 194.05,16.83 ZD2.A | SW1.1 19,35.48 20.57,33.91 21.97,33.91 33.47,22.42 33.47,9.4 36.83,6.03 159.83,6.16 170.5,16.83 192.14,16.83
AC_L_OUT
  Top 0.406: Q2.A1 166.56,41.72 161.67,41.72 R3.2
  Top 0.813: B1.AC2 125.66,10.55 125.13,11.08
  Top 2.032: NTC1.1 147.36,13.08 127.13,13.08 125.13,11.08 120.08,6.03 41.91,6.03 37.02,10.92 37.02,23.94 32.07,28.89 32.07,42.93 28.76,46.24 C1.1
  Bottom 2.032: Q2.A1 170.5,37.85 171.01,38.35 179.83,38.35 182.5,35.69 182.5,30.61 179.51,27.62 175.07,27.62 171.51,24.07 161.16,24.07 156.91,19.81 153.42,19.81 150.09,16.49 NTC1.1 | SW1.1A 19,55.77 19.81,56.58 25.46,56.58 27.88,54.17 28.44,53.6 28.76,53.28 C1.1
AC_N_IN
  Bottom 2.032: ZD1.A 202.31,52.33 VAR2.1 202.31,41 J1.N 198.3,35.5 189.67,26.86 189.67,24.19 185.35,19.88 162.12,19.88 159.89,17.65 159.89,12 157.48,9.59 38.35,9.59 37.02,10.92 37.02,23.88 24,36.9 SW1.2
AC_N_OUT
  Top 0.813: R9.1 154.06,9.28 154.24,9.46 | R8.1 157.86,9.46 | B1.AC1 132.98,9.22 133.06,9.3
  Top 2.032: SW1.2A 24,45.6 28.76,40.84 C1.2 28.76,27.06 33.47,22.35 33.47,9.4 40.89,1.97 125.73,1.97 133.06,9.3 133.22,9.46 154.24,9.46 157.86,9.46 X1.5
  Bottom 2.032: X1.5 X1.2 X2.2
AC_OUT_L  (via drill 0.4)
  Top 0.61: R4.2 165.54,44.89 | 165.54,44.89 R6.2 | v165.54,44.26 165.54,44.89
  Top 0.813: X1.4 173.34,13.72 164.78,13.72 C2.1
  Top 1.016: 170.56,16.19 170.66,16.29
  Top 2.032: X2.1 X1.1 X1.4 173.29,13.66 170.66,16.29 165.04,21.91 Q1.A2
  Bottom 0.61: Q2.A2 165.54,38.29 v165.54,44.26
  Bottom 2.032: Q2.A2 Q1.A2
AUX  (via drill 0.4)
  Top 0.254: R34.2 134.87,40.07 | 134.87,40.07 134.94,40.01 | v125.79,46.86 126.43,46.23 133.6,46.23 134.87,44.96 134.87,44.64 | 134.87,40.07 134.87,44.64 | D5.A 134.91,44.61 134.87,44.64
  Top 0.406: 125.27,48.58 D3.A 125.73,49.04
  Top 0.508: C17.2 125.96,49.41 D3.A
  Top 0.61: v125.79,46.86 125.79,48.26 125.73,48.32 125.52,48.32 125.27,48.58
  Bottom 0.406: TR1.6 112.47,46.85
  Bottom 0.61: 112.47,46.85 114.3,45.02 123.95,45.02 v125.79,46.86
AUX_OUT  (via drill 0.4)
  Top 0.305: v135.7,52.2 C18.1 | v133.22,36.51 130.15,36.51 C20.2 128.68,37.15 IC2.5
  Top 0.61: C18.1 135.7,55.12 | 135.7,55.12 135.7,55.63 | 135.7,55.63 135.7,56.13 134.94,56.9 126.81,56.9 R28.2 | 135.63,55.56 135.7,55.63 | ZD5.C 135.64,55.18 135.7,55.12
  Bottom 0.305: v135.7,52.2 136.21,51.69 136.21,49.15 133.41,46.35 133.41,36.7 v133.22,36.51
AUX_REC
  Top 0.508: R30.1 128.08,55.24 126.43,53.59
  Top 0.61: R28.1 124.27,54.9 D3.C 125.75,53.59 126.43,53.59
DC_BUS  (via drill 0.4)
  Top 0.254: 118.26,25.31 118.45,25.31 | C11.1 117.86,24.77 117.47,24.77 | 117.47,39.47 R23.1
  Top 0.305: v115.63,38.92 116.8,38.92 R23.1
  Top 1.016: 114.63,25.39 114.94,25.33 | R22.1 121.54,21.59 121.67,21.72
  Top 1.27: 118.26,25.31 C11.1 114.94,25.33 113.97,25.33 | 113.97,25.33 TR1.2 | C13.+ 132.44,25.25 L1.P$2 126.4,25.25 122.87,21.72 121.67,21.72 117.58,21.72 113.97,25.33
  Bottom 0.305: TR1.2 112.71,26.85 115.63,29.78 v115.63,38.92
DRAIN
  Top 0.305: C7.1 R11.1
  pour Top (isolate 0.305, no thermals): 73.34,58.48 74.23,59.37 83.44,59.31 84.84,58.42 84.84,55.12 83.63,55.12 83.63,51.5 73.91,51.5 73.34,52.07
FAN_OUT
  Top 0.305: 95.06,55.18 X4.1
  Top 0.406: C5.2 106.74,55.18 X5.1 | C3.2 95.06,55.18
  Top 0.813: 84.78,57.53 93.09,57.53 X4.1 | 84.78,57.53 R11.2 | 106.74,55.18 106.74,55.63 103.76,58.61 85.79,58.61 84.78,57.59 84.78,57.53
FAN_SENSE1  (via drill 0.4)
  Top 0.254: 53.02,28.32 ZD4.C 51.68,27.56 49.78,27.56 48.96,28.38 R17.2 R13.1
  Top 0.305: 52.77,28.83 ZD4.C 52.96,28.64 54.29,29.97 v54.29,34.67 | v58.42,34.67 58.42,34.73 61.21,37.53 71.63,37.53 74.93,40.83 v74.93,46.55
  Bottom 0.305: X4.3 86.61,51.82 80.14,51.82 74.93,46.61 v74.93,46.55 | v54.29,34.67 v58.42,34.67
FAN_SENSE2  (via drill 0.4)
  Top 0.254: R14.1 50.41,43.18 R21.2 52.01,44.7 53.47,44.7 54.17,44.01 ZD3.C
  Top 0.305: v58.48,39.37 59.69,38.16 71.37,38.16 74.3,41.08 74.3,45.4 74.04,45.66 74.04,46.93 74.61,47.5 v77.03,47.5 | ZD3.C 54.17,41.85 v54.99,41.02
  Bottom 0.305: X5.3 97.66,51.18 80.71,51.18 v77.03,47.5 | v54.99,41.02 56.83,41.02 v58.48,39.37
FB1
  Top 0.254: 84.64,16.07 84.52,16.07
  Top 0.305: OK3.2 91.95,17.34 90.74,16.13 R35.2 90.1,16.07 IC3.1 84.64,16.07 | C27.1 82.11,20.32 82.11,20.26 84.52,17.84 84.52,16.07
GND  (via drill 0.4)
  Top 0.254: IC1.5 IC1.4 IC1.3 46.04,32.51 v46.35,32.19 | IC1.8 49.58,33.45 v49.78,33.47 | ZD4.A v52.77,33.47 | C8.2 v50.8,28.51 | ZD3.A v54.17,38.54 | C6.1 v42.42,37.53 | C4.1 v41.4,36.58 | Q6.3 79.01,51.71
  Top 0.305: v88.27,15.05 IC3.3 | R42.1 v78.93,14.22 | v52.32,43.62 C10.2 | Q5.2 v47.56,18.35 | R10.1 Q4.2 v70.1,40.51 | v58.61,27.43 59.38,27.43 C23.2 | v60.96,43.81 61.98,43.24 62.04,43.31 C16.2 | R5.1 68.01,43.69 Q3.2 v70.1,43.05 | R27.2 80.2,32.89 v79.31,32.89
  Top 0.406: R27.2 80.33,33.34 | v75.88,52.07 76.22,52.07 Q6.1
  Top 0.813: Q6.1 Q6.2 79.01,51.71
  Bottom 0.305: 40.51,57.98 40.58,58.04 | v79.31,32.89 80.17,32.04
  Bottom 1.016: C19.2 88.2,15.88 | 88.2,15.88 78.8,15.88 | 78.8,15.88 75.63,15.88 C22.- | v78.93,14.22 78.93,15.75 78.8,15.88 | v88.27,15.05 88.27,15.81 88.2,15.88
  Bottom 1.27: X3.8 58.42,50.42 | C15.- 70.48,24.83 C22.-
  Bottom 1.778: TR1.9 84.99,36.85 80.17,32.04 71.06,22.92 C22.-
  other vias: 75.88,51.31 58.61,26.67 60.96,44.58
  pour Bottom (isolate 0.305): 38.61,60.2 38.61,35.05 46.61,27.05 46.61,15.56 47.18,14.99 62.74,14.99 68.58,20.83 68.58,22.1 67.44,22.54 67.44,23.69 68.71,23.69 68.71,24.51 69.34,25.15 69.34,32 69.91,32.58 76.01,32.58 76.52,33.08 76.52,60.26
HOLE_UL  (via drill 3.2 pad 5.5)
  other vias: 37,49.5
HOLE_UM  (via drill 3.2 pad 5.5)
  other vias: 120,49.5
HOLE_UR  (via drill 3.2 pad 5.5)
  other vias: 211.5,49.5
N$1  (via drill 0.4)
  Top 0.406: v168.02,26.67 168.28,26.42 168.91,26.42 R1.1
  Top 2.032: Q1.A1 159.58,20.3 NTC1.2
  Bottom 0.406: Q1.A1 159.96,29.53 163.07,26.42 167.77,26.42 v168.02,26.67
N$2
  Top 0.254: C8.1 49.24,31.14 R17.1
  Top 0.305: IC1.7 48.58,31.24 R17.1
N$3
  Top 0.254: IC1.12 47.31,39.75 46.99,40.07 45.28,40.07 44.58,40.77 R20.1
N$4
  Top 0.305: JP1.COM 103.63,14.41 C19.1
N$5
  Top 0.305: OK3.1 90.74,18.61 R35.1 R32.2
N$6
  Top 2.032: VAR1.1 194.49,32.32 SAR1.P$1
  Bottom 2.032: VAR2.2 195.26,49.97 196.91,48.32 196.91,42.93 191.95,37.97 SAR1.P$1
N$7
  Top 0.305: OK2.2 175.64,57.02 175.32,56.71 170.94,56.71 R7.1
N$8
  Top 0.61: C14.1 R25.2
N$9
  Top 1.016: C12.+ 136.91,18.22 B1.+ 130.76,19.45 L1.P$1
N$10
  Top 0.305: OK1.2 155.13,56.9 154.75,56.52 150.62,56.52 R2.1
N$11
  Top 0.254: R26.2 R29.1
N$12
  Top 0.254: JP2.COM 81.36,22.27 82.04,21.59 82.93,21.59 85.34,19.18 85.34,18.04
  Top 0.305: 85.34,18.04 R32.1
N$13
  Top 0.305: R12.2 48.07,19.24 Q5.3
N$14  (via drill 0.4)
  Top 0.305: LED1.C 7,25.73 10.41,29.15 10.41,50.8 16.51,56.9 38.48,56.9 v38.67,56.71 | R12.1 46.17,21.78 v46.55,21.4
  Bottom 0.305: v46.55,21.4 46.55,27.11 39.18,34.48 39.18,43.24 41.21,45.28 41.21,52.26 38.67,54.8 v38.67,56.71
N$15
  Top 0.305: C7.2 R18.2 82.66,51.71 Q6.4
N$16  (via drill 0.4)
  Top 0.305: R7.2 v166.88,57.85 | Q4.3 73.66,42.29 73.66,45.21 v73.15,45.72
  Bottom 0.305: v166.88,57.85 158.43,57.85 158.05,58.23 113.73,58.23 105.28,49.78 81.92,49.78 77.98,45.85 75.44,45.85 75.06,45.47 73.41,45.47 v73.15,45.72
N$17
  Top 0.813: R24.2 R22.2
N$18
  Top 0.254: IC1.11 47.94,39.88 R19.1
N$20  (1 unrouted)
  Top 0.254: 127.51,44.19 127.51,42.42 | 127.51,42.42 127.51,41.06 IC2.8 | R38.1 127.57,42.48 127.51,42.42
N$21
  Top 0.254: C10.1 52.04,41.28 R21.1 49.21,40.01 IC1.9
N$22
  Top 0.254: R37.2 R33.1
N$49
  Top 0.254: R23.2 117.41,43.12 117.92,43.62 R26.1
N$71
  Top 0.406: OK1.6 158.69,47.68 158.69,41.4 | 158.69,41.4 158.69,38.67 Q2.G | R3.1 158.82,41.27 158.69,41.4
N$72  (via drill 0.4)
  Top 0.406: R1.2 171.26,28.77 Q1.G | OK2.4 171.9,48.7 v171.89,48.7
  Bottom 0.406: Q1.G 170.5,32.77 167.64,35.62 167.64,44.45 v171.89,48.7
N$73
  Top 0.406: R6.1 168.08,50.8 168.21,50.93 177.16,50.93 178.18,49.91 OK2.6
N$76
  Top 0.406: R4.1 163.39,50.93 163.45,50.99 153.54,50.99 152.59,50.04 OK1.4
N$83
  Top 0.813: R8.2 162.24,3.68 C2.2
  Top 1.016: R9.2 R8.2
N$137
  Top 1.016: D2.C 118.43,29.27 | 118.43,29.27 118.43,28.7 C11.2 | R24.1 118.52,29.36 118.43,29.27
N$138  (via drill 0.4)
  Top 0.254: C25.2 129.61,40.13 | C25.2 129.61,40.52 131.44,42.35 C28.1 | C25.2 129.61,39.94 129.6,39.94
  Top 0.305: OK3.4 100.17,19.34 v100.2,19.37 | IC2.7 127.47,39.75 v128.65,39.75 128.84,39.94 129.6,39.94
  Bottom 0.305: v100.2,19.37 100.2,32.13 108.33,40.26 113.03,40.26 113.73,40.96 127.44,40.96 v128.65,39.75
N$140
  Top 0.406: R30.2 C17.1
N$141
  Top 0.254: R34.1 136.59,40 R36.1 | R40.2 129.6,37.85 130.24,37.21 132.72,37.21 133.6,38.1 R36.1 | C26.1 136.1,36.42 134.69,37.84 R36.1
  Top 0.305: IC2.6 R40.2
N$146
  Top 0.61: R31.2 C21.1
N$148
  Top 0.254: 81.85,15.3 53.34,15.3 R37.1
  Top 0.305: IC3.2 82.04,14.03 R42.2 81.85,15.3 C24.2 R39.2
N$149
  Top 0.305: C27.2 R39.1 C24.1
N$152
  Top 0.254: C25.1 131.51,40.45 133.41,42.35 R41.1
N$155
  Top 0.254: D5.C D6.C | 137.03,42.01 D6.C | R36.2 137.41,38.1 137.67,38.35 D6.C
NFAULT  (via drill 0.4)
  Top 0.305: IC1.13 46.67,37.53 46.93,37.27 46.93,36.32 v46.74,36.13
  Bottom 0.305: X3.15 68.33,47.88 67.18,49.02 67.18,51.12 64.45,53.85 48.9,53.85 46.1,51.05 46.1,38.23 45.21,37.34 45.21,36.45 45.59,36.07 46.67,36.07 v46.74,36.13
PE  (via drill 0.4, 3.2 pad 5.5)  (5 unrouted)
  Top 0.406: JP1.NC v121.47,13.14 | v170.24,11.68 158.12,11.68 v156.84,12.95
  Top 1.016: X3.1 X3.2 50.67,54.23 46.23,58.67 7.27,58.67 SW1.PE2
  Top 2.032: ZD1.C 189.67,47.15 SAR1.P$2 194.27,42.55 201.79,42.55 211,33.34 J1.PE
  Bottom 0.406: 169.8,1.97 169.67,2.1 170.24,2.1 v170.24,11.68 | v121.47,13.14 122.36,12.26 156.15,12.26 v156.84,12.95
  Bottom 1.016: 120.24,2 120.27,1.97
  Bottom 1.524: SW1.PE2 SW1.PE1 10.54,29.06 10.54,20.38 15.43,15.5 J5.1
  Bottom 2.032: 173.4,1.97 169.8,1.97 120.27,1.97 30.29,1.97 25.5,6.76 J5.1 | 173.4,1.97 178.9,1.97 | 178.9,1.97 188.21,1.97 | X2.3 188.21,1.97 | 205.35,6.03 J4.P$1 204.97,1.97 200.14,1.97 | 205.35,6.03 J4.P$2 205.35,24.35 J1.PE 213.1,27.9 ZD2.C | 200.14,1.97 J3.P$1 J3.P$2 | v211.5,5.5 205.88,5.5 205.35,6.03 | X1.6 173.4,1.97 | X1.3 178.9,1.97 | 188.21,1.97 194.94,1.97 | 194.94,1.97 200.14,1.97 | 194.94,1.97 J2.P$1 J2.P$2
  other vias: 15,5.5
PWM_OUT  (via drill 0.4)
  Top 0.305: R15.2 90.11,50.61 90.11,50.16 89.28,49.34 67.75,49.34 67.12,49.97 67.12,51.12 66.23,52.01 57.53,52.01 v57.21,51.69 | X4.4 87.63,53.53 89.85,51.31 89.85,50.99 R15.2 | X5.4 99.31,51.94 96.46,49.09 91.75,49.09 R15.2 | v83.19,54.42 83.19,53.85 R18.1 | IC1.6 47.94,34.54 48.64,35.24 v48.64,36.58
  Bottom 0.305: v83.19,54.42 86.68,54.42 X4.4 | v48.64,36.58 48.01,37.21 48.01,50.29 49.66,51.94 56.96,51.94 v57.21,51.69
PWR_DIR_OUT  (via drill 0.4)
  Top 0.254: R16.2 46.17,24.77 47.18,25.78 52.32,25.78 55.12,28.57 v55.12,33.78
  Top 0.305: R2.2 146.49,57.91 v145.73,57.15 | R16.2 45.66,24.45 45.02,23.81 45.02,21.08 45.72,20.38 Q5.1 | v58.42,33.66 58.67,33.66 59.31,34.29 59.31,34.73 61.47,36.89 71.88,36.89 75.56,40.58 75.56,44.7 v75.82,44.96 | Q3.3 v72.26,43.69
  Bottom 0.305: v145.73,57.15 145.29,57.59 113.98,57.59 105.54,49.15 82.17,49.15 77.98,44.96 v75.82,44.96 74.55,43.69 v72.26,43.69 | v55.12,33.78 58.29,33.78 v58.42,33.66
PWR_DIRECT
  Top 0.254: R5.2
  Top 0.305: Q3.1 R5.2 | R5.2 | X3.12 64.64,49.15 64.64,47.12 66.04,45.72 R5.2
PWR_SSTART
  Top 0.305: X3.11 63.37,46.35 67.82,41.91 68.01,41.91 | Q4.1 68.01,41.91 | 68.01,41.91 R10.2
SSCL  (via drill 0.4)
  Top 0.305: IC1.15 45.4,37.53 45.21,37.34 45.21,36.45 46.35,35.31 47.43,35.31 v47.69,35.56
  Bottom 0.305: X3.13 65.79,47.88 64.64,49.02 64.64,51.88 63.94,52.58 49.4,52.58 47.37,50.55 47.37,36.83 47.69,36.51 v47.69,35.56
SSDA  (via drill 0.4)
  Top 0.305: IC1.14 v46.04,36.96
  Bottom 0.305: X3.14 65.91,51.5 64.2,53.21 49.15,53.21 46.74,50.8 46.74,37.66 v46.04,36.96
TEMP1_N
  Top 0.254: X6.2 42.74,55.44 42.1,54.8 42.1,44.92 39.88,42.69 39.88,36.05 40.17,35.75 41.59,35.75 | 41.59,35.75 44.49,35.75 45.4,34.84 IC1.2 | C9.2 41.66,35.69 41.59,35.75
TEMP1_P
  Top 0.254: X6.1 40.96,55.44 41.59,54.8 41.59,45.13 39.37,42.9 39.37,35.43 40.83,33.97 41.72,33.97 | IC1.1 44.77,34.76 44.28,35.24 43.37,35.24 42.99,34.86 42.99,34.29 42.67,33.97 41.72,33.97 | C9.1 41.98,33.28 41.98,33.72 41.72,33.97
VIPER_D  (via drill 0.4)
  Top 0.254: 114.63,35.13 116.39,35.13
  Top 1.27: 116.39,35.13 114.18,35.13 TR1.4
  other vias: 120.46,35.81 120.46,35.05 120.46,34.29 120.46,33.53
  pour Top (isolate 0.305, no thermals): 113.54,36.13 123.32,36.13 123.32,31.75 121.16,31.75 121.16,32.89 120.84,33.21 115.44,33.21 113.54,35.12
  pour Bottom (isolate 0.305, no thermals): 117.47,36.13 123.25,36.13 123.25,31.75 121.09,31.75 121.09,32.89 120.78,33.21 117.47,33.21

### Text on the board
Bottom: EEZ DIB AUX PS (03/2019 r2B1)
tPlace: EEZ DIB AUX PS / (03/2019 r2B1) | Project source code: github.com/eez-open/modular-psu | CAUTION! / HIGH VOLTAGE